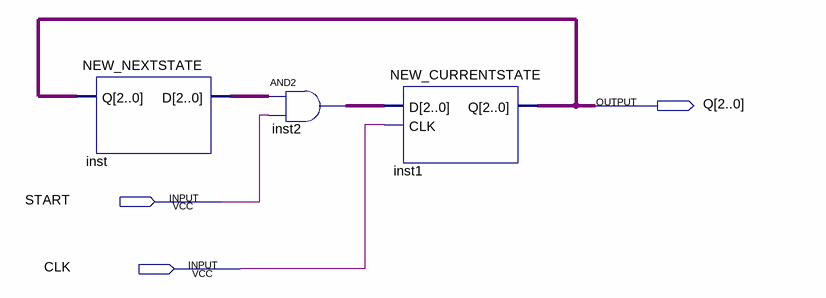
[diagram p0: schematic sheet]
// Quartus schematic NEW_FSM.bdf as structural Verilog: 3 symbols, 3 pins
module NEW_FSM (
  input  START,
  input  CLK,
  output [2:0] Q
);

  wire [2:0] inst2_out, inst_d;

  NEW_NEXTSTATE inst (.Q(Q), .D(inst_d));
  assign inst2_out = inst_d & {3{START}};  // AND2 inst2, 3 bits wide
  NEW_CURRENTSTATE inst1 (.D(inst2_out), .CLK(CLK), .Q(Q));
endmodule
